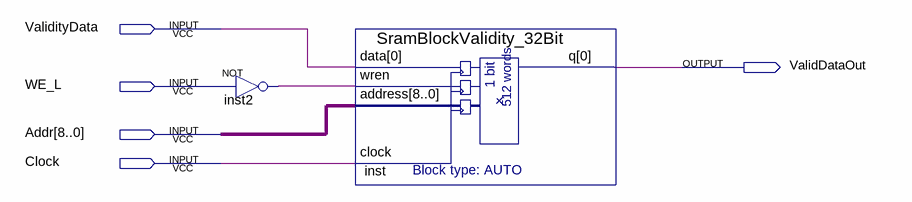
[diagram p0: schematic sheet]
// Quartus schematic Valid.bdf as structural Verilog: 2 symbols, 5 pins
module Valid (
  input  ValidityData,
  input  WE_L,
  input  [8:0] Addr,
  input  Clock,
  output ValidDataOut
);

  wire inst2_out;

  not inst2 (inst2_out, WE_L);
  SramBlockValidity_32Bit inst (.data(ValidityData), .wren(inst2_out), .address(Addr), .clock(Clock), .q(ValidDataOut));
endmodule
